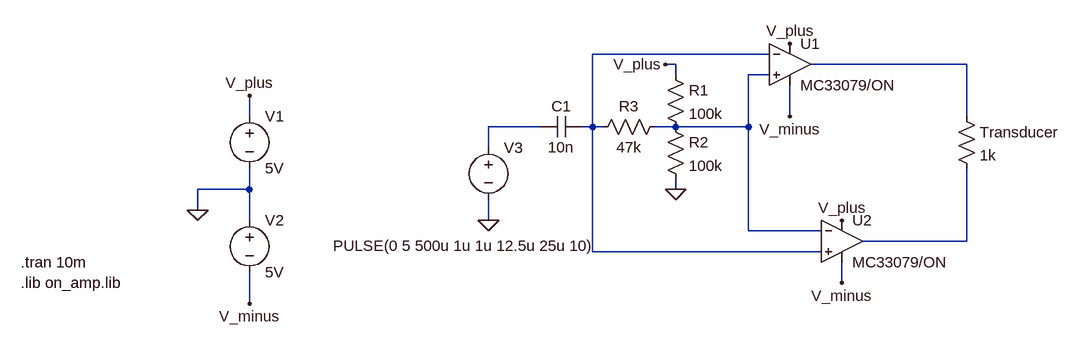
[diagram p0: schematic opamp_send.asc]
opamp_send.asc, the LTspice schematic file:
Version 4
SHEET 1 880 680
WIRE 160 -16 -112 -16
WIRE 16 0 0 0
WIRE 464 0 224 0
WIRE 16 16 16 0
WIRE 160 16 128 16
WIRE -640 80 -640 48
WIRE 192 80 192 32
WIRE 464 80 464 0
WIRE -192 96 -272 96
WIRE -112 96 -112 -16
WIRE -112 96 -128 96
WIRE -96 96 -112 96
WIRE 16 96 -16 96
WIRE 128 96 128 16
WIRE 128 96 16 96
WIRE -272 128 -272 96
WIRE -640 192 -640 160
WIRE -640 192 -720 192
WIRE 16 192 16 176
WIRE -720 224 -720 192
WIRE -640 240 -640 192
WIRE -272 240 -272 208
WIRE 128 256 128 96
WIRE 240 256 128 256
WIRE 464 272 464 160
WIRE 464 272 304 272
WIRE -112 288 -112 96
WIRE 240 288 -112 288
WIRE 272 336 272 304
WIRE -640 368 -640 320
FLAG -720 224 0
FLAG -640 48 V_plus
FLAG -640 368 V_minus
FLAG 272 336 V_minus
FLAG 192 80 V_minus
FLAG 192 -32 V_plus
FLAG 272 240 V_plus
FLAG 16 192 0
FLAG 0 0 V_plus
FLAG -272 240 0
SYMBOL Opamps\\opamp2 192 -64 R0
SYMATTR InstName U1
SYMATTR Value MC33079/ON
SYMBOL Opamps\\opamp2 272 208 R0
SYMATTR InstName U2
SYMATTR Value MC33079/ON
SYMBOL voltage -640 64 R0
WINDOW 123 0 0 Left 0
WINDOW 39 0 0 Left 0
SYMATTR InstName V1
SYMATTR Value 5V
SYMBOL voltage -640 224 R0
WINDOW 123 0 0 Left 0
WINDOW 39 0 0 Left 0
SYMATTR InstName V2
SYMATTR Value 5V
SYMBOL res 0 0 R0
SYMATTR InstName R1
SYMATTR Value 100k
SYMBOL res 0 80 R0
SYMATTR InstName R2
SYMATTR Value 100k
SYMBOL voltage -272 112 R0
WINDOW 123 0 0 Left 0
WINDOW 39 0 0 Left 0
WINDOW 3 -239 167 Left 0
SYMATTR InstName V3
SYMATTR Value PULSE(0 5 500u 1u 1u 12.5u 25u 10)
SYMBOL res 448 64 R0
SYMATTR InstName Transducer
SYMATTR Value 1k
SYMBOL res 0 80 R90
WINDOW 0 0 56 VBottom 0
WINDOW 3 32 56 VTop 0
SYMATTR InstName R3
SYMATTR Value 47k
SYMBOL cap -128 80 R90
WINDOW 0 0 32 VBottom 0
WINDOW 3 32 32 VTop 0
SYMATTR InstName C1
SYMATTR Value 10n
TEXT -992 336 Left 0 !.lib on_amp.lib
TEXT -992 304 Left 0 !.tran 10m

The netlist it stands for:
* opamp_send.asc
XU1 N003 N001 V_plus V_minus N002 MC33079/ON  ; pins In+ In- V+ V- OUT
XU2 N001 N003 V_plus V_minus N005 MC33079/ON  ; pins In+ In- V+ V- OUT
V1 V_plus 0 5V
V2 0 V_minus 5V
R1 V_plus N003 100k
R2 N003 0 100k
V3 N004 0 PULSE(0 5 500u 1u 1u 12.5u 25u 10)
R§Transducer N002 N005 1k
R3 N003 N001 47k
C1 N001 N004 10n
.lib on_amp.lib
.tran 10m
.backanno
.end